# Altium project PCB_Project.PrjPcb
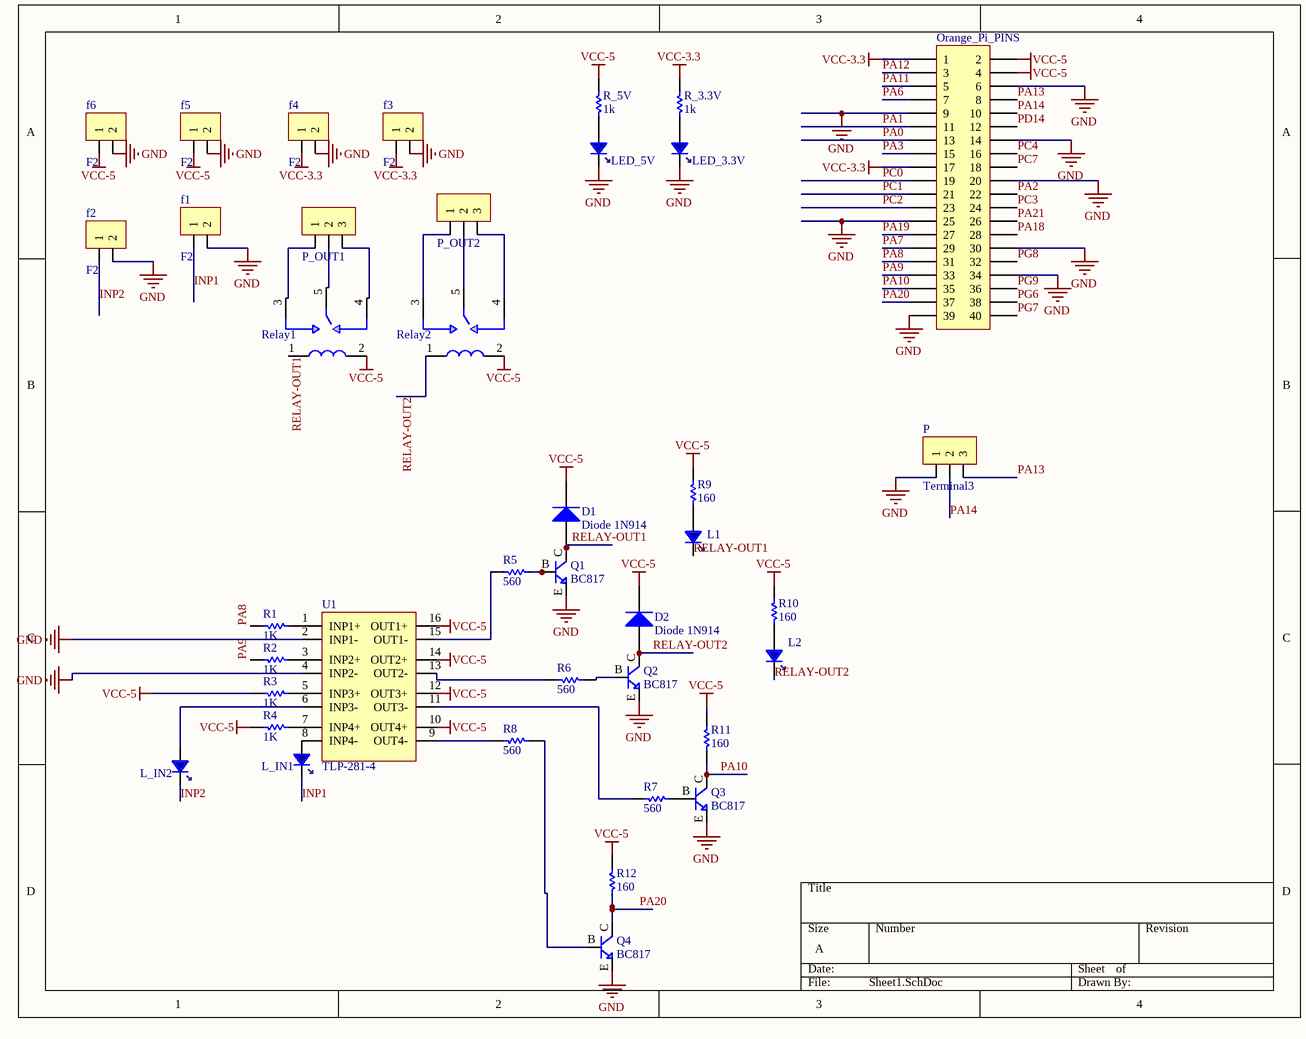
[diagram p0: Sheet1.SchDoc]
1 sheet, 39 parts. Net scope: global (net labels, ports and power ports of the same name join across sheets).
Board file: PCB1.PcbDoc

## Sheet Sheet1.SchDoc
size A

### Parts
D1  Diode 1N914  [DO-35]
D2  Diode 1N914  [DO-35]
f1  F2  [PCBComponent_1]
f2  F2  [PCBComponent_1]
f3  F2  [PCBComponent_1]
f4  F2  [PCBComponent_1]
f5  F2  [PCBComponent_1]
f6  F2  [PCBComponent_1]
L1  LED_0805  [LED_0805]  (value not drawn)
L2  LED_0805  [LED_0805]  (value not drawn)
L_IN1  LED_0805  [LED_0805]  (value not drawn)
L_IN2  LED_0805  [LED_0805]  (value not drawn)
LED_3.3V  LED_0805  [LED_0805]  (value not drawn)
LED_5V  LED_0805  [LED_0805]  (value not drawn)
Orange_Pi_PINS  Header 20X2  [HDR2X20]  (value not drawn)
P  Terminal3  [TERMINAL-3]
P_OUT1  Terminal3  [TERMINAL-3]  (value not drawn)
P_OUT2  Terminal3  [TERMINAL-3]  (value not drawn)
Q1  BC817  [PCBComponent_1 - duplicate2]
Q2  BC817  [PCBComponent_1 - duplicate2]
Q3  BC817  [PCBComponent_1 - duplicate2]
Q4  BC817  [PCBComponent_1 - duplicate2]
R1  value 1K  [ResS]  (hidden comment: Res_0805)
R2  value 1K  [ResS]  (hidden comment: Res_0805)
R3  value 1K  [ResS]  (hidden comment: Res_0805)
R4  value 1K  [ResS]  (hidden comment: Res_0805)
R5  value 560  [ResS]  (hidden comment: Res_0805)
R6  value 560  [ResS]  (hidden comment: Res_0805)
R7  value 560  [ResS]  (hidden comment: Res_0805)
R8  value 560  [ResS]  (hidden comment: Res_0805)
R9  value 160  [ResS]  (hidden comment: Res_0805)
R10  value 160  [ResS]  (hidden comment: Res_0805)
R11  value 160  [ResS]  (hidden comment: Res_0805)
R12  value 160  [ResS]  (hidden comment: Res_0805)
R_3.3V  value 1k  [ResS]  (hidden comment: Res_0805)
R_5V  value 1k  [ResS]  (hidden comment: Res_0805)
Relay1  JOC-3FF  [PCBComponent_1]  (value not drawn)
Relay2  JOC-3FF  [PCBComponent_1]  (value not drawn)
U1  TLP-281-4  [TLP281-4]

### Nets
GND: f1.2 f2.2 f3.2 f4.2 f5.2 f6.2 LED_3.3V.2(CATHODE) LED_5V.2(CATHODE) Orange_Pi_PINS.6 Orange_Pi_PINS.9 Orange_Pi_PINS.14 Orange_Pi_PINS.20 Orange_Pi_PINS.25 Orange_Pi_PINS.30 Orange_Pi_PINS.34 Orange_Pi_PINS.39 P.1 Q1.E Q2.E Q3.E Q4.E U1.2(INP1-) U1.4(INP2-)
VCC-3.3: f3.1 f4.1 Orange_Pi_PINS.1 Orange_Pi_PINS.17 R_3.3V.1
VCC-5: D1.2(K) D2.2(K) f5.1 f6.1 Orange_Pi_PINS.2 Orange_Pi_PINS.4 R3.1 R4.1 R9.2 R10.2 R11.2 R12.2 R_5V.2 Relay1.2 Relay2.2 U1.10(OUT4+) U1.12(OUT3+) U1.14(OUT2+) U1.16(OUT1+)
INP1: f1.1 L_IN1.2(CATHODE)
INP2: f2.1 L_IN2.2(CATHODE)
PA0: Orange_Pi_PINS.13
PA1: Orange_Pi_PINS.11
PA2: Orange_Pi_PINS.22
PA3: Orange_Pi_PINS.15
PA6: Orange_Pi_PINS.7
PA7: Orange_Pi_PINS.29
PA8: Orange_Pi_PINS.31 R1.2
PA9: Orange_Pi_PINS.33 R2.1
PA10: Orange_Pi_PINS.35 Q3.C R11.1
PA11: Orange_Pi_PINS.5
PA12: Orange_Pi_PINS.3
PA13: Orange_Pi_PINS.8 P.3
PA14: Orange_Pi_PINS.10 P.2
PA18: Orange_Pi_PINS.28
PA19: Orange_Pi_PINS.27
PA20: Orange_Pi_PINS.37 Q4.C R12.1
PA21: Orange_Pi_PINS.26
PC0: Orange_Pi_PINS.19
PC1: Orange_Pi_PINS.21
PC2: Orange_Pi_PINS.23
PC3: Orange_Pi_PINS.24
PC4: Orange_Pi_PINS.16
PC7: Orange_Pi_PINS.18
PD14: Orange_Pi_PINS.12
PG6: Orange_Pi_PINS.38
PG7: Orange_Pi_PINS.40
PG8: Orange_Pi_PINS.32
PG9: Orange_Pi_PINS.36
RELAY-OUT1: D1.1(A) L1.2(CATHODE) Q1.C Relay1.1
RELAY-OUT2: D2.1(A) L2.2(CATHODE) Q2.C Relay2.1
NetL1_1: L1.1(ANODE) R9.1
NetL2_1: L2.1(ANODE) R10.1
NetL_IN1_1: L_IN1.1(ANODE) U1.8(INP4-)
NetL_IN2_1: L_IN2.1(ANODE) U1.6(INP3-)
NetLED_3.3V_1: LED_3.3V.1(ANODE) R_3.3V.2
NetLED_5V_1: LED_5V.1(ANODE) R_5V.1
NetP_OUT1_1: P_OUT1.1 Relay1.3
NetP_OUT1_2: P_OUT1.2 Relay1.5
NetP_OUT1_3: P_OUT1.3 Relay1.4
NetP_OUT2_1: P_OUT2.1 Relay2.3
NetP_OUT2_2: P_OUT2.2 Relay2.5
NetP_OUT2_3: P_OUT2.3 Relay2.4
NetQ1_B: Q1.B R5.2
NetQ2_B: Q2.B R6.2
NetQ3_B: Q3.B R7.2
NetQ4_B: Q4.B R8.2
NetR1_1: R1.1 U1.1(INP1+)
NetR2_2: R2.2 U1.3(INP2+)
NetR3_2: R3.2 U1.5(INP3+)
NetR4_2: R4.2 U1.7(INP4+)
NetR5_1: R5.1 U1.15(OUT1-)
NetR6_1: R6.1 U1.13(OUT2-)
NetR7_1: R7.1 U1.11(OUT3-)
NetR8_1: R8.1 U1.9(OUT4-)

### Library data of the parts
D1 D2 = Diode 1N914: High Conductance Fast Diode; Published: 8-Jun-2000; LatestRevisionDate: 17-Jul-2002; LatestRevisionNote: Re-released for DXP Platform.; DatasheetVersion: 1997; PackageReference: DO-35; Publisher: Altium Limited; PackageDescription: Diode, Axial; Body 3.8 x 1.9 mm (LxDia. max), Lead Dia. 0.53 mm (max); Code_JEDEC: DO-204-AH; ComponentLink1Description: Manufacturer Link; ComponentLink1URL: http://www.fairchildsemi.com/; ComponentLink2Description: Datasheet; ComponentLink2URL: http://www.fairchildsemi.com/ds/1N%2F1N4448.pdf
f1-f6 = Component_1
Orange_Pi_PINS = Header 20X2: Header, 20-Pin, Dual row; LatestRevisionDate: 17-Jul-2002; LatestRevisionNote: Re-released for DXP Platform.; Publisher: Altium Limited
P P_OUT1 P_OUT2 = Terminal-3
Q1-Q4 = Transistor_SMD_NPN
Relay1 Relay2 = Relay-5VDC: Relay
U1 = OPTO-TLP281-4